# EAGLE design arduino_dust_density_meter (EAGLE 9.4.2)
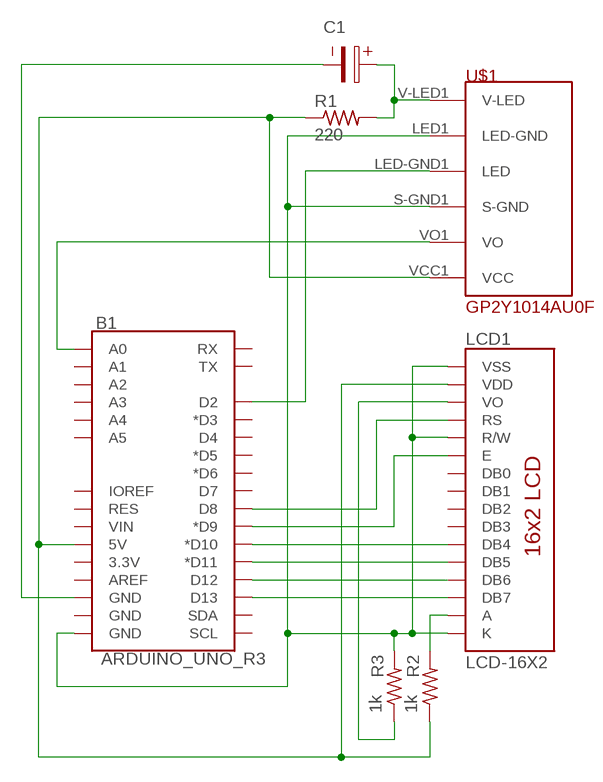
[diagram p0: schematic, sheet 1]

## Parts
B1  ARDUINO_UNO_R3  ARDUINO_UNO_R3_SHIELDBASIC  [UNO_R3_SHIELD]
C1  WCAP-PTG5_10X12,5_870025575007  [10X5X0.9(DXAXB)]
LCD1  LCD-16X2  LCD-16X2NOHOLES  [LCD-16X2_NOHOLESNOSILK]
R1  220  R-US_0309/12  [0309/12]
R2  1k  R-US_0309/12  [0309/12]
R3  1k  R-US_0309/12  [0309/12]
U$1  GP2Y1014AU0F  [GP2Y1014AU0F]

## Nets
N$1: C1.1 R1.2 U$1.V-LED1(V-LED)
N$2: B1.5V LCD1.2(VDD) R1.1 R2.1 U$1.VCC1(VCC)
N$3: B1.GND@2(GND) C1.2
N$4: B1.GND@0(GND) LCD1.1(VSS) LCD1.5(R/W) LCD1.16(K) R3.2 U$1.LED1(LED-GND) U$1.S-GND1(S-GND)
N$5: B1.D2 U$1.LED-GND1(LED)
N$6: B1.A0 U$1.VO1(VO)
N$7: B1.D13 LCD1.14(DB7)
N$8: B1.D12 LCD1.13(DB6)
N$9: B1.D11(*D11) LCD1.12(DB5)
N$10: B1.D10(*D10) LCD1.11(DB4)
N$11: B1.D9(*D9) LCD1.6(E)
N$12: B1.D8 LCD1.4(RS)
N$13: LCD1.15(A) R2.2
N$14: LCD1.3(VO) R3.1
Unconnected: B1.3.3V B1.A1 B1.A2 B1.A3 B1.A4 B1.A5 B1.AREF B1.D3(*D3) B1.D4 B1.D5(*D5) B1.D6(*D6) B1.D7 B1.GND@1(GND) B1.IOREF B1.RES B1.RX B1.SCL B1.SDA B1.TX B1.VIN LCD1.7(DB0) LCD1.8(DB1) LCD1.9(DB2) LCD1.10(DB3)

## Library data of the parts
B1 = SparkFun-Boards:ARDUINO_UNO_R3_SHIELD: Arduino R3 Shield Footprint Shield form compatible with the Arduino Uno R3. SparkFun Products: MG2639 Cellular Shield <https://www.sparkfun.com/products/13120> MIDI Shield <https://www.sparkfun.com/products/12898> R3 Stackable Headers Kit <https://www.sparkfun.com/products/11417>
C1 = Wurth_Elektronik_Passive_Capacitors_rev18b:WCAP-PTG5: WCAP-PTG5 Aluminum Polymer Capacitors Characteristics Aluminum Polymer Capacitor Recommended soldering: Wave Operating temperature: -55°C to +105°C Low ESR at high frequency range High permissible ripple current Load life: 2000h @ +105°C Package name and Variant abbreviation: Package: D X A X B = Diameter of the outline X Pitch of the hole X Diameter of the hole. Variant: D X L X P X Ø = Diameter of the body part X Height of the body part X Pitch of the pin X Diameter of the pin. <http://katalog.we-online.de/media/images/eisos/WCAP-PTG5_pf2.jpg> Details see: http://katalog.we-online.de/en/pbs/WCAP-PTG5/ Created: 2015-02-06 2015 (C) Wurth Elektronik; WE-NUMBER: 870025575007/220uF
LCD1 = SparkFun-Displays:LCD-16X2: Standard text-only 16x2 parallel input LCD Basic 16 character by 2 line display. Typically utilizes the extremely common HD44780 parallel interface chipset SparkFun Products: Basic 16x2 Green <https://www.sparkfun.com/products/255> Basic 8x2 Green <https://www.sparkfun.com/products/11122>; SF_ID: LCD-00255
R1-R3 = BeagleBone_Black_Wireless:R-US_: RESISTOR, American symbol
U$1 = sharp-dust-sensor:GP2Y1014AU0F: GP2Y1014AU0F -Optical Dust Sensor Technical Specifications: VCC: 4.5-5.5V Operating Temperature: -20°C to 65°C Digikey: 1855-1013-ND Mouser: 852-GP2Y1014AU0F

## Board
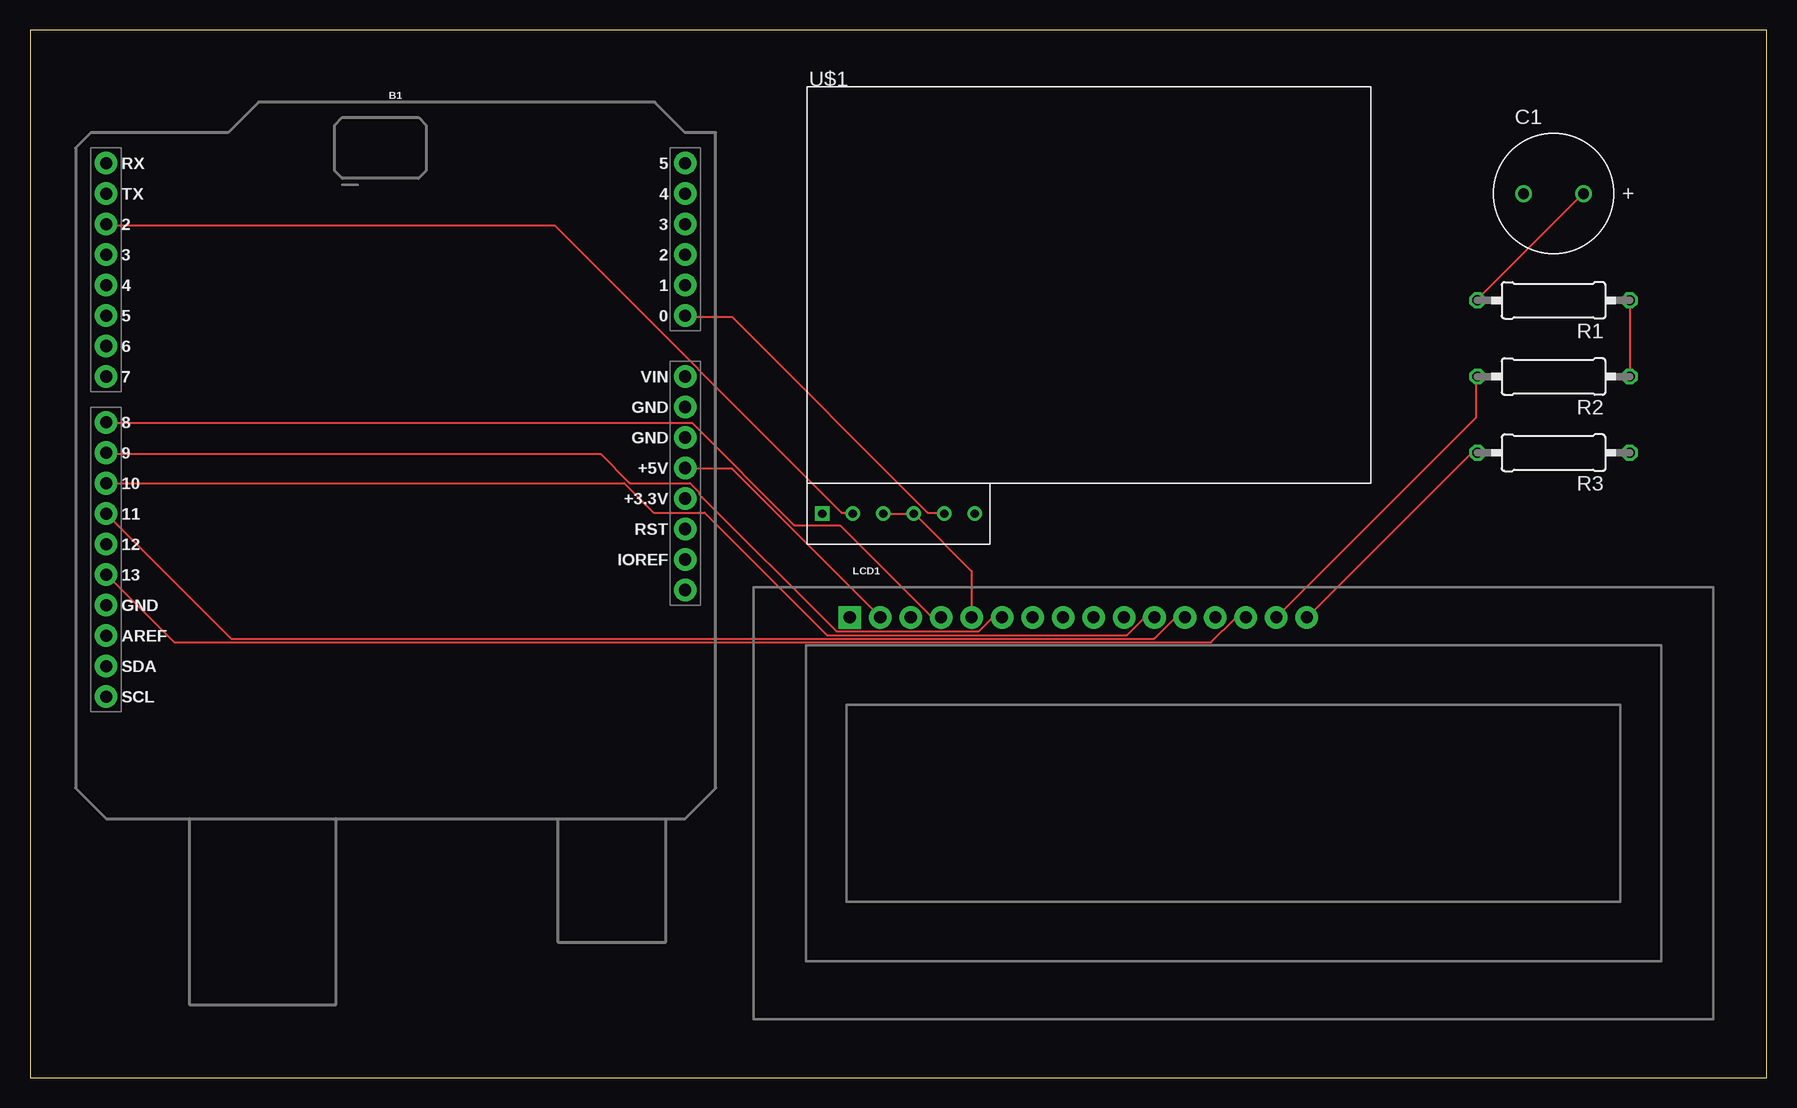
[diagram p1: board, top side]
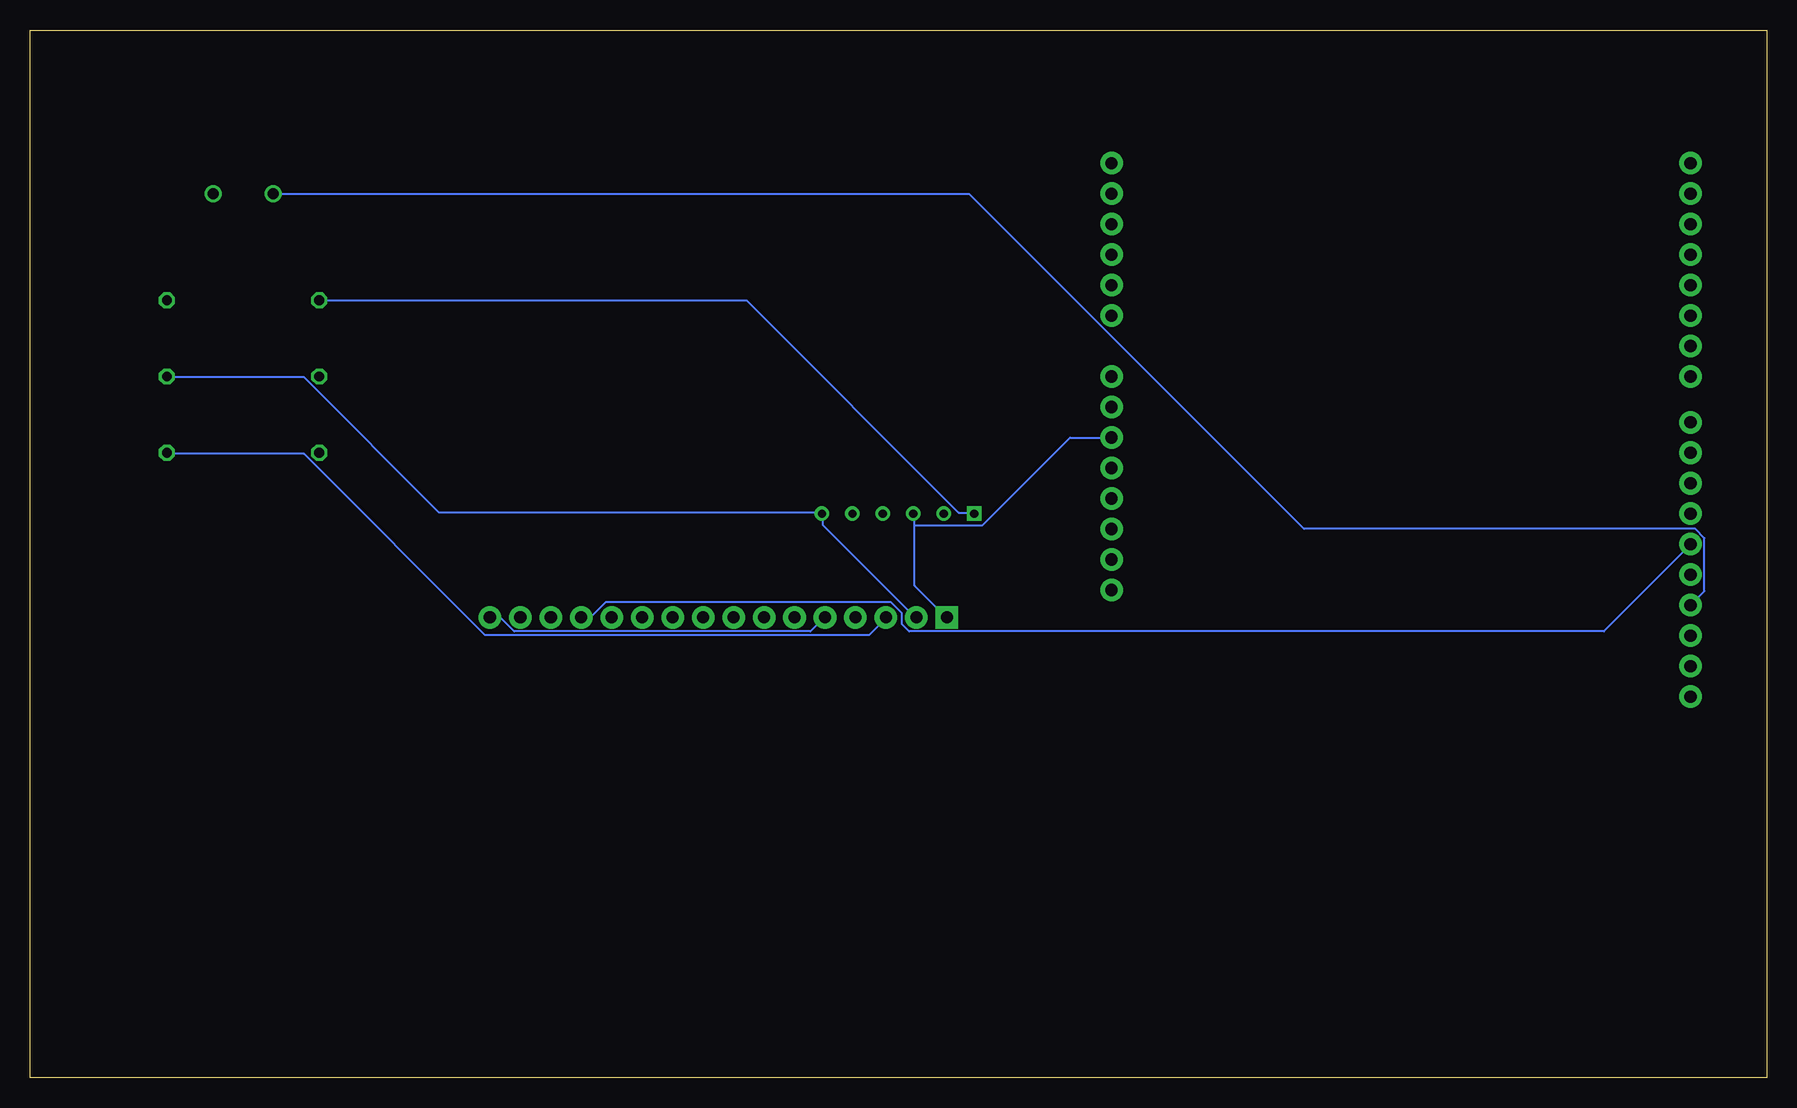
[diagram p2: board, bottom side, seen from below]

Size 144.76 x 87.3 mm. Coordinates in mm from the lower left corner, seen from the top.
Outline: 0,0 144.76,0 144.76,87.3 0,87.3 0,0
Copper layers (1*16): Top 0.035mm / dielectric 1.5mm / Bottom 0.035mm
Design rules "default": minimum track width 6mil, minimum drill 0.35mm, track to track 6mil, track to pad 6mil, pad to pad 6mil, via to via 6mil, smd to smd 6mil, copper to edge 40mil, drill to drill 6mil, minimum pad ring 10mil, minimum via ring 8mil, stop-mask expansion 4mil, vias tented up to drill 0mil, thermal gap 10mil

### Footprints (pad centres in the part's own frame; a part is rotated, then mirrored left to right if it is on the bottom)
UNO_R3_SHIELD = drill 1.016 pad 1.88: 3.3V 24.13,-2.54; 5V 24.13,0; A0 24.13,12.7; A1 24.13,15.24; A2 24.13,17.78; A3 24.13,20.32; A4 24.13,22.86; A5 24.13,25.4; AREF -24.13,-13.97; D2 -24.13,20.32; D3 -24.13,17.78; D4 -24.13,15.24; D5 -24.13,12.7; D6 -24.13,10.16; D7 -24.13,7.62; D8 -24.13,3.81; D9 -24.13,1.27; D10 -24.13,-1.27; D11 -24.13,-3.81; D12 -24.13,-6.35; D13 -24.13,-8.89; GND@0 24.13,2.54; GND@1 24.13,5.08; GND@2 -24.13,-11.43; IOREF 24.13,-7.62; NC 24.13,-10.16; RES 24.13,-5.08; RX -24.13,25.4; SCL -24.13,-19.05; SDA -24.13,-16.51; TX -24.13,22.86; VIN 24.13,7.62
10X5X0.9(DXAXB) = drill 0.9: 1 2.5,0; 2 -2.5,0
LCD-16X2_NOHOLESNOSILK = drill 1.016 pad 1.88 square: 1 -32,15.5 | drill 1.016 pad 1.88: 2 -29.46,15.5; 3 -26.92,15.5; 4 -24.38,15.5; 5 -21.84,15.5; 6 -19.3,15.5; 7 -16.76,15.5; 8 -14.22,15.5; 9 -11.68,15.5; 10 -9.14,15.5; 11 -6.6,15.5; 12 -4.06,15.5; 13 -1.52,15.5; 14 1.02,15.5; 15 3.56,15.5; 16 6.1,15.5
0309/12 = drill 0.813 octagon: 1 -6.35,0; 2 6.35,0
GP2Y1014AU0F = drill 0.7: LED1 -17.78,-19.05; LED-GND1 -20.32,-19.05; S-GND1 -15.24,-19.05; VCC1 -10.16,-19.05; VO1 -12.7,-19.05 | drill 0.7 square: V-LED1 -22.86,-19.05

### Placement (x,y rotation side)
B1  30.48,50.8 0 top
C1  127,73.66 0 top
LCD1  100.33,22.86 0 top
R1  127,64.77 180 top
R2  127,58.42 180 top
R3  127,52.07 180 top
U$1  88.9,66.04 0 top

### Tracks (layer width: path | path; a pad name or v marks a point on that pad's centre or on a via)
N$1
  Top 0.152: C1.1 129.39,73.61 120.55,64.77 R1.2
  Bottom 0.152: R1.2 85.04,64.77 67.36,47.09 66.14,47.09 U$1.V-LED1
N$2
  Top 0.152: R1.1 R2.1 | B1.5V 54.71,50.75 58.52,50.75 70.87,38.41 LCD1.2
  Bottom 0.152: LCD1.2 71.02,38.41 78.64,46.02 78.64,46.94 U$1.VCC1 78.79,47.09 110.64,47.09 121.92,58.37 133.35,58.37 R2.1
N$3
  Bottom 0.152: B1.GND@2 5.18,40.54 5.18,44.96 5.94,45.72 38.56,45.72 66.45,73.61 124.36,73.61 C1.2
N$4
  Top 0.152: R3.2 120.55,51.97 120.09,51.97 106.53,38.41 LCD1.16 | U$1.LED1 71.17,46.94 73.61,46.94 U$1.S-GND1 73.76,46.94 78.49,42.22 78.49,38.41 LCD1.5
  Bottom 0.152: 71.02,46.02 71.02,41 68.43,38.41 LCD1.1 | 71.02,46.02 71.02,46.94 U$1.LED1 | B1.GND@0 58.06,53.34 65.38,46.02 71.02,46.02 | LCD1.16 106.38,38.25 105.46,38.25 104.39,37.19 79.7,37.19 78.64,38.25 LCD1.5
N$5
  Top 0.152: U$1.LED-GND1 68.58,47.09 67.67,47.09 43.74,71.02 6.4,71.02 B1.D2
N$6
  Top 0.152: U$1.VO1 76.2,47.09 74.83,47.09 58.52,63.4 54.71,63.4 B1.A0
N$7
  Top 0.152: LCD1.14 101.35,38.25 100.43,38.25 98.45,36.27 12.04,36.27 6.4,41.91 B1.D13
N$8
  Bottom 0.152: LCD1.13 98.75,38.41 97.99,38.41 96.77,39.62 73,39.62 72.08,38.71 72.08,37.8 71.48,37.19 13.56,37.19 6.4,44.35 B1.D12
N$9
  Top 0.152: B1.D11 16.76,36.58 93.73,36.58 95.4,38.25 96.16,38.25 LCD1.12
N$10
  Top 0.152: B1.D10 49.53,49.53 51.97,47.09 56.24,47.09 66.45,36.88 91.44,36.88 92.81,38.25 93.73,38.25 LCD1.11
N$11
  Top 0.152: LCD1.6 80.92,38.25 80.16,38.25 79.1,37.19 67.21,37.19 55.78,48.62 55.78,48.77 55.02,49.53 49.99,49.53 47.55,51.97 6.4,51.97 B1.D9
N$12
  Top 0.152: LCD1.4 75.89,38.41 75.13,38.41 67.51,46.02 63.7,46.02 55.17,54.56 6.4,54.56 B1.D8
N$13
  Top 0.152: R2.2 120.55,58.37 120.55,55.02 103.94,38.41 LCD1.15
N$14
  Bottom 0.152: R3.1 133.35,51.97 121.92,51.97 106.83,36.88 74.83,36.88 73.46,38.25 LCD1.3